# Altium schematic sheet Current Voltage Sensors.SchDoc
size A4
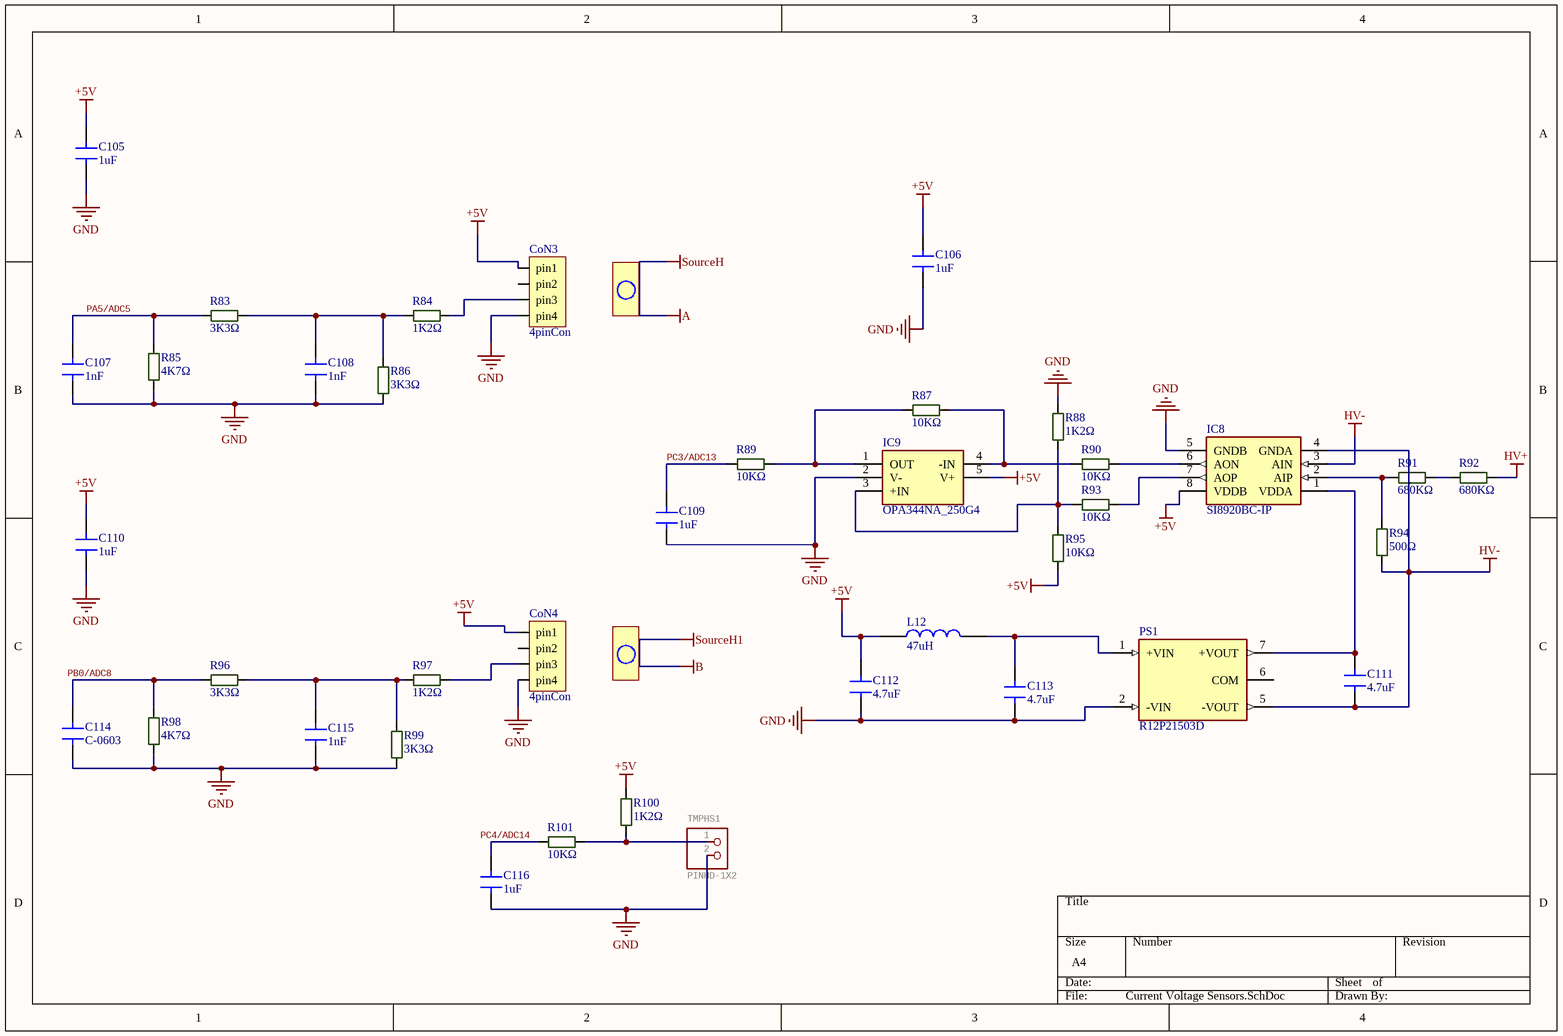
[diagram p0: Current Voltage Sensors.SchDoc]

## Parts
*1  current transducer  [currenttransducer]  (value not drawn)
*2  current transducer  [currenttransducer]  (value not drawn)
C105  1uF  [C-0603W]
C106  1uF  [C-0805]
C107  1nF  [C-0603W]
C108  1nF  [C-0603W]
C109  1uF  [C-0805]
C110  1uF  [C-0603W]
C111  4.7uF  [C-1206]
C112  4.7uF  [C-1206]
C113  4.7uF  [C-1206]
C114  C-0603  [C-0603W]
C115  1nF  [C-0603W]
C116  1uF  [C-0805]
CoN3  4pinCon  [4pinCon]
CoN4  4pinCon  [4pinCon]
IC8  SI8920BC-IP  [SOP254P965X419-8N]
IC9  OPA344NA_250G4  [SOT95P280X145-5N]
L12  47uH  [WE-TPC_282892]
PS1  R12P21503D  [CONV_R12P21503D]
R83  3K3Ω  [R-0603R]
R84  1K2Ω  [R-0603R]
R85  4K7Ω  [R-0603R]
R86  3K3Ω  [R-0603R]
R87  10KΩ  [R-0805]
R88  1K2Ω  [R-0805]
R89  10KΩ  [R-0805]
R90  10KΩ  [R-0805]
R91  680KΩ  [R-1206]
R92  680KΩ  [R-1206]
R93  10KΩ  [R-0805]
R94  500Ω  [R-1206]
R95  10KΩ  [R-0805]
R96  3K3Ω  [R-0603R]
R97  1K2Ω  [R-0603R]
R98  4K7Ω  [R-0603R]
R99  3K3Ω  [R-0603R]
R100  1K2Ω  [R-0805]
R101  10KΩ  [R-0805]
TMPHS1  PINHD-1X2  [1X02]

## Nets
+5V: C105.2 C106.2 C110.2 C112.2 CoN3.1(pin1) CoN4.1(pin1) IC8.8(VDDB) IC9.5(V+) L12.1 R95.1 R100.1
GND: C105.1 C106.1 C107.1 C108.1 C109.1 C110.1 C112.1 C113.1 C114.1 C115.1 C116.1 CoN3.4(pin4) CoN4.4(pin4) IC8.5(GNDB) IC9.2(V-) PS1.2(-VIN) R85.1 R86.1 R88.2 R98.1 R99.1 TMPHS1.2
HV+: R92.2
HV-: C111.1 IC8.3(AIN) IC8.4(GNDA) PS1.5(-VOUT) R94.1
PA5/ADC5: C107.2 R83.1 R85.2
PB0/ADC8: C114.2 R96.1 R98.2
PC3/ADC13: C109.2 R89.2
PC4/ADC14: C116.2 R101.2
NetC108_2: C108.2 R83.2 R84.1 R86.2
NetC111_2: C111.2 IC8.1(VDDA) PS1.7(+VOUT)
NetC113_2: C113.2 L12.2 PS1.1(+VIN)
NetC115_2: C115.2 R96.2 R97.1 R99.2
NetCoN3_3: CoN3.3(pin3) R84.2
NetCoN4_3: CoN4.3(pin3) R97.2
NetIC8_2: IC8.2(AIP) R91.1 R94.2
NetIC8_6: IC8.6(AON) R90.2
NetIC8_7: IC8.7(AOP) R93.2
NetIC9_1: IC9.1(OUT) R87.2 R89.1
NetIC9_3: IC9.3(+IN) R88.1 R93.1 R95.2
NetIC9_4: IC9.4(-IN) R87.1 R90.1
NetR91_2: R91.2 R92.1
NetR100_2: R100.2 R101.1 TMPHS1.1

Not connected (* = marked no-connect by the designer): CoN3 2(pin2); CoN4 2(pin2); PS1 6(COM)

## Library data of the parts
C105 C107 C108 C110 C115 = C-0603
C106 C109 C116 = C-0805
C111 = C-1206
C112 C113 = Cap1206: Cap1206 4.7uF; Özdisan Part Number: CL31B475KBHNNNE; Manufacturer: SAMSUNG; Link: https://www.ozdisan.com/pasif-komponentler/kondansatorler/smd-kondansatorler-mlcc/CL31B475KBHNNNE; Price: 0,10407
IC8 = SI8920BC-IP: Integrated Circuit; Manufacturer_Name: Silicon Labs; Datasheet Link: https://mouser.componentsearchengine.com/Datasheets/2/SI8920BC-IP.pdf; Height: 4.19mm; Manufacturer_Part_Number: SI8920BC-IP; Mouser Part Number: 634-SI8920BC-IP; Mouser Price/Stock: https://www.mouser.co.uk/ProductDetail/Silicon-Labs/SI8920BC-IP?qs=bB7QTEcmLuN2VIVidYwh9w%3D%3D; Arrow Part Number: SI8920BC-IP; Arrow Price/Stock: https://www.arrow.com/en/products/si8920bc-ip/silicon-labs?region=nac
IC9 = OPA344NA_250G4: Integrated Circuit; Manufacturer_Name: Texas Instruments; Manufacturer_Part_Number: OPA344NA/250G4; Datasheet Link: http://www.ti.com/lit/ds/symlink/opa344.pdf; Height: 1.45mm; Mouser Part Number: 595-OPA344NA/250G4; Mouser Price/Stock: https://www.mouser.co.uk/ProductDetail/Texas-Instruments/OPA344NA-250G4?qs=7nS3%252BbEUL6s62po7Pq3eXQ%3D%3D; Arrow Part Number: OPA344NA/250G4; Arrow Price/Stock: https://www.arrow.com/en/products/opa344na250g4/texas-instruments?region=nac
L12 = inductor
PS1 = R12P21503D: 2W DC/DC-Converter 'ECONOLINE' SIP7 6.4kV unreg; MF: Recom Power; SnapEDA_Link: https://www.snapeda.com/parts/R12P21503D/Recom%20Power/view-part/1592429/?ref=snap; Value: *; Digi-Key_Purchase_URL: https://www.digikey.ca/product-detail/en/recom-power/R12P21503D/945-3069-5-ND/7354331?utm_source=snapeda&utm_medium=aggregator&utm_campaign=symbol; Digi-Key_Part_Number: 945-3069-5-ND; MP: R12P21503D; Package: SIP-7 Recom Power
R83-R86 R96-R99 = R-0603
R87-R90 R93 R95 R100 R101 = R-0805
R91 R92 R94 = R-1206: Res1206
TMPHS1 = PINHD-1X2: PIN HEADER; GateName_1: G$1; SymbolName_1: PINHD2; LibraryName: pinhead; DeviceSetName: PINHD-1X2